# Altium schematic sheet FPGA_EEM_Misc.SchDoc
size 420 x 297 mm; EDA_Number: ARTIQ; CompanyName: WUT ISE; Organization: WUT ISE; DocumentNumber: 18; SheetNumber: 6; ModifiedBy: -; Title2: FPGA EEM/BP + MISC; ModifiedDate: -
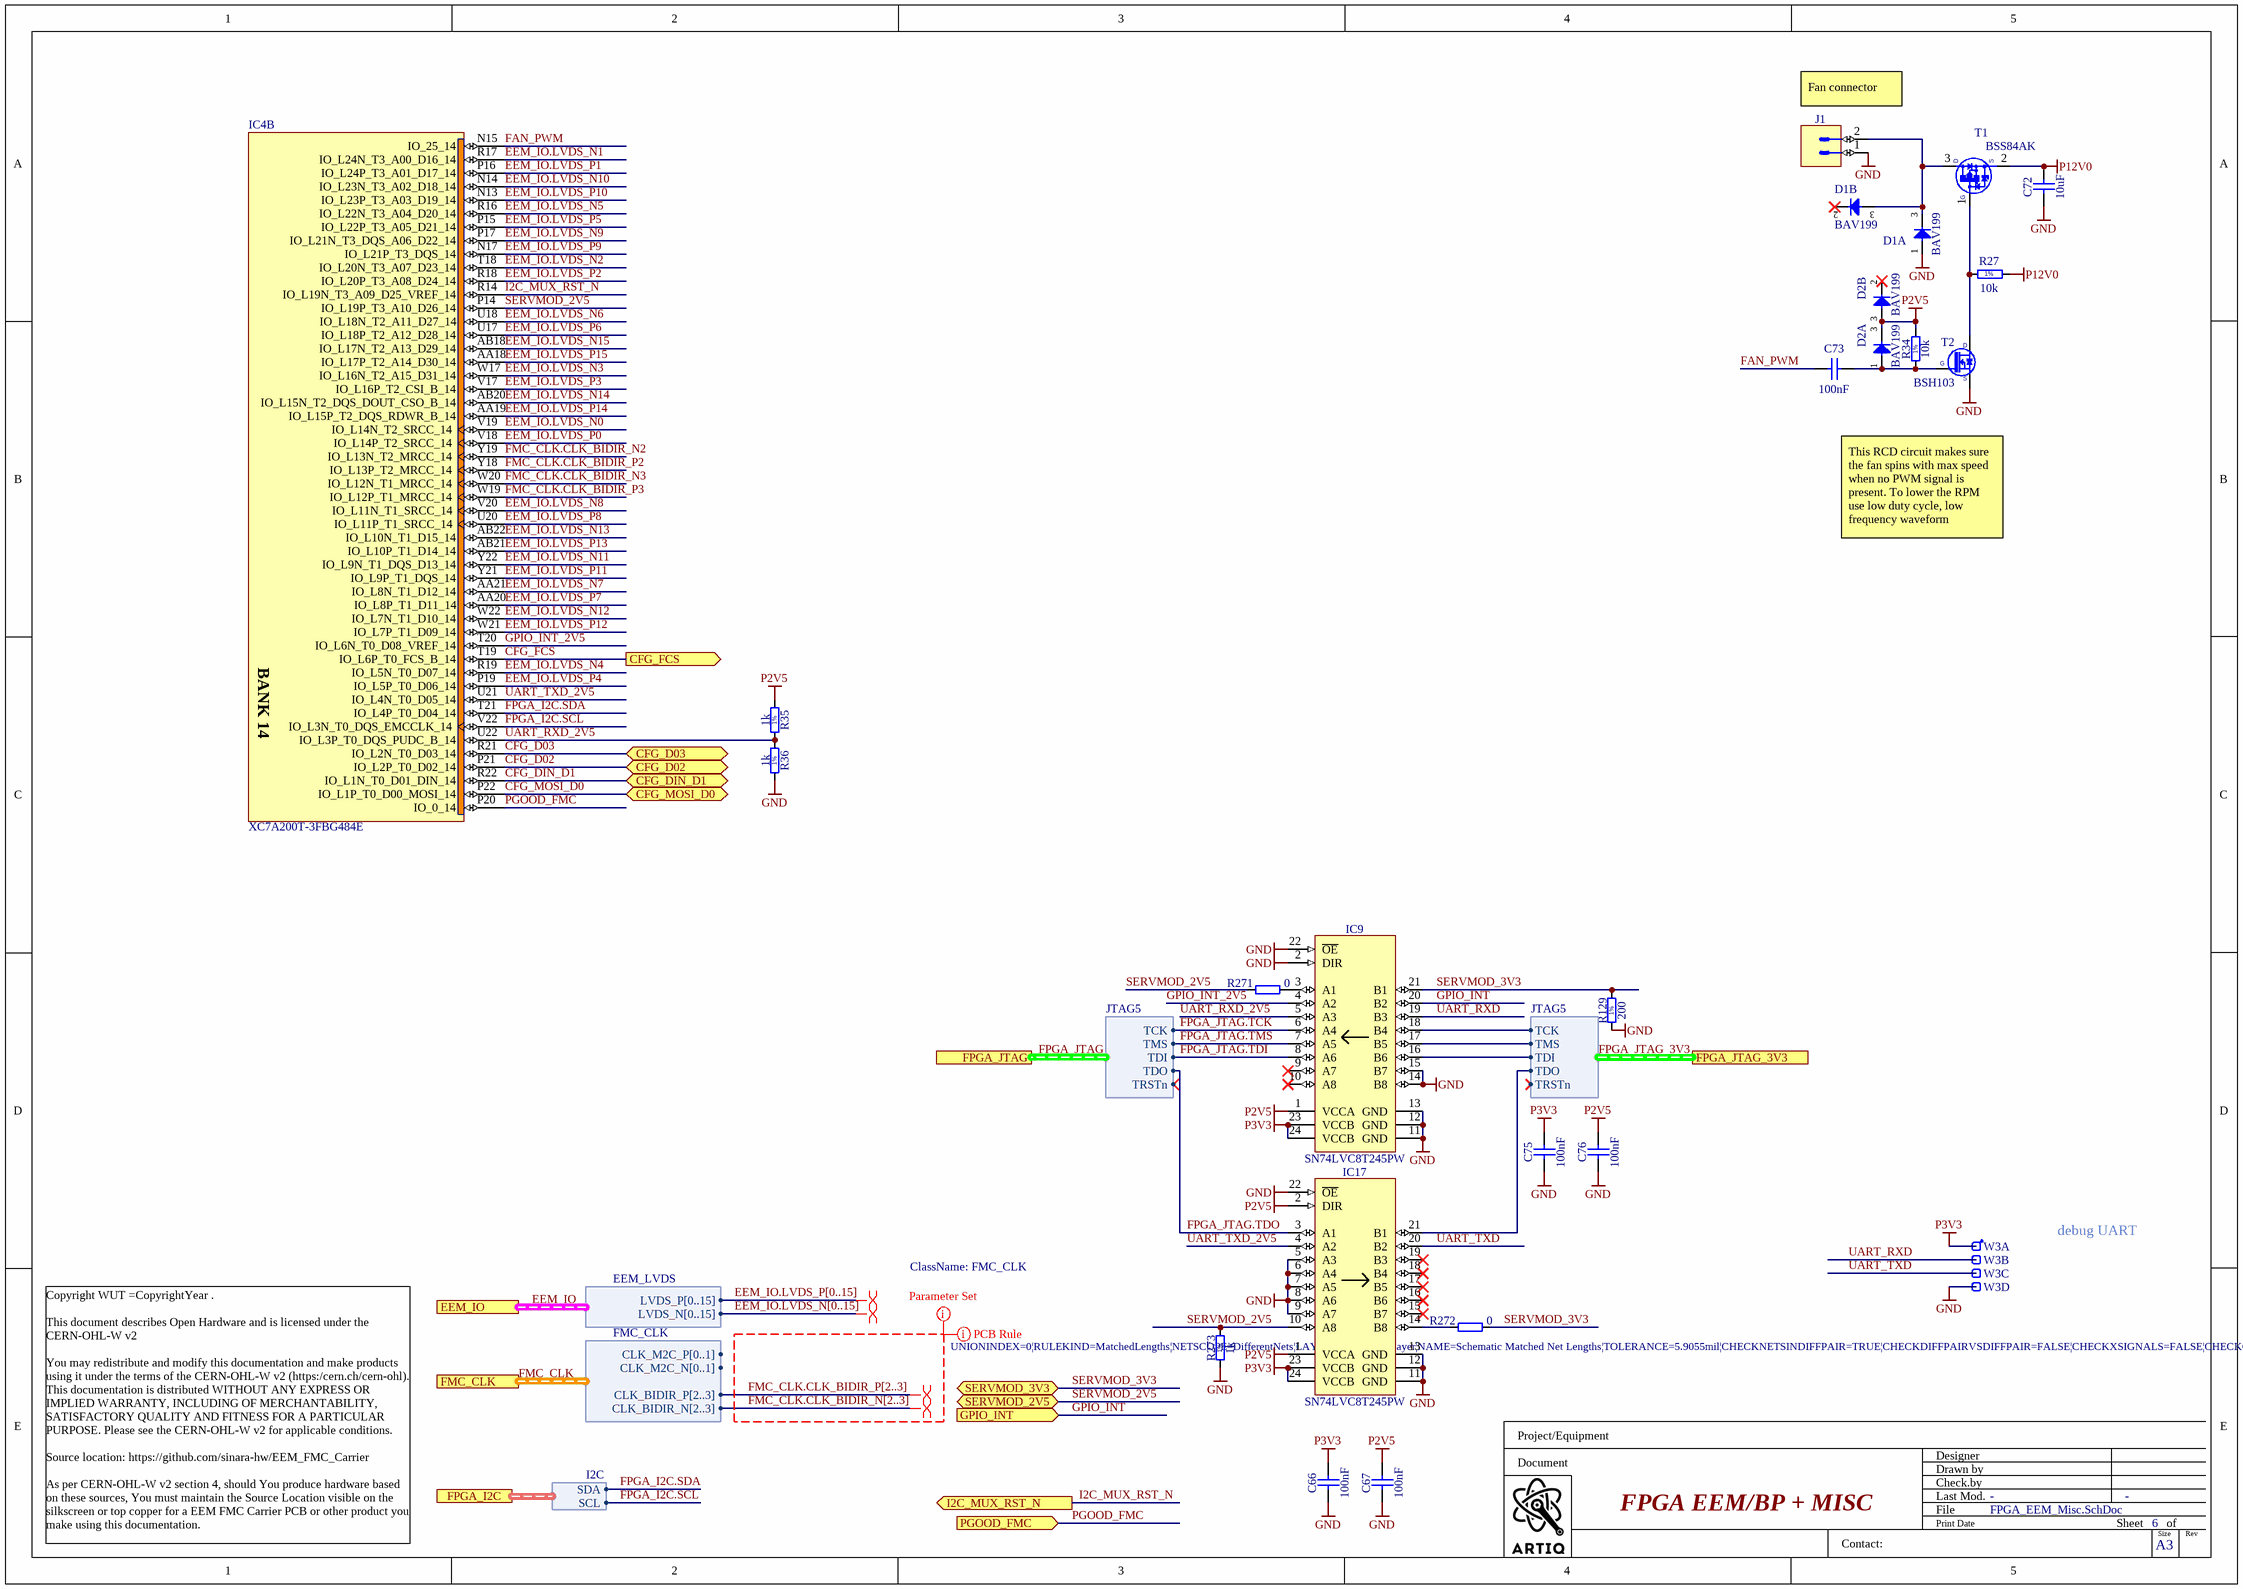
[diagram p0: FPGA_EEM_Misc.SchDoc]

## Parts
C66  100nF  [CAPC1005X55N]
C67  100nF  [CAPC1005X55N]
C72  10uF  [CAPC2012X95N]
C73  100nF  [CAPC0603X33N]
C75  100nF  [CAPC1005X55N]
C76  100nF  [CAPC1005X55N]
D1  BAV199  [SOT95P240X110-3N]  (parts A,B of 2)
D2  BAV199  [SOT95P240X110-3N]  (parts A,B of 2)
IC4  XC7A200T-3FBG484E  [BGA484C100P22X22_2300X2300X254]  (part B of 10)
IC9  SN74LVC8T245PW  [SOP65P640X120-24N]
IC17  SN74LVC8T245PW  [SOP65P640X120-24N]
J1  KK®  [MOLEX_22-27-2021]  (value not drawn)
R27  10k  [RESC1005X40N]
R34  10k  [RESC1005X40N]
R35  1k  [RESC1005X40N]
R36  1k  [RESC1005X40N]
R129  200  [RESC1005X40N]
R271  0  [RESC1005X40N]
R272  0  [RESC1005X40N]
R273  1k  [RESC1005X40N]
T1  BSS84AK  [SOT95P230X110-3N]
T2  BSH103  [SOT95P230X110-3N]
W3  Header 4  [SAMTEC_HTSW-104-23-L-S]  (value not drawn)  (parts A,B,C,D of 4)

## Ports
CFG_D02 (bidir), CFG_D03 (bidir), CFG_DIN_D1 (bidir), CFG_FCS (out), CFG_MOSI_D0 (bidir), EEM_IO (harness EEM_LVDS), FMC_CLK (harness FMC_CLK), FPGA_I2C (harness I2C), FPGA_JTAG (harness JTAG5), FPGA_JTAG_3V3 (harness JTAG5), GPIO_INT (in), I2C_MUX_RST_N (out), PGOOD_FMC (in), SERVMOD_2V5 (bidir), SERVMOD_3V3 (bidir)

## Harnesses
FMC_CLK: CLK_M2C_P[0..1], CLK_M2C_N[0..1], CLK_BIDIR_P[2..3], CLK_BIDIR_N[2..3]
EEM_LVDS: LVDS_P[0..15], LVDS_N[0..15]
I2C: SDA, SCL
JTAG5: TCK, TDI, TDO, TMS, TRSTn

## Nets
GND: C66.1 C67.1 C72.1 C75.1 C76.1 D1.1(A) IC9.2(DIR) IC9.11(GND) IC9.12(GND) IC9.13(GND) IC9.14(B8) IC9.15(B7) IC9.22(~{OE}) IC17.5(A3) IC17.6(A4) IC17.7(A5) IC17.8(A6) IC17.9(A7) IC17.11(GND) IC17.12(GND) IC17.13(GND) IC17.22(~{OE}) J1.1 R36.1 R129.1 R273.1 T2.2(S) W3.4
P2V5: C67.2 C76.2 D2.3(COMAC) IC9.1(VCCA) IC17.1(VCCA) IC17.2(DIR) R34.2 R35.2
P3V3: C66.2 C75.2 IC9.23(VCCB) IC9.24(VCCB) IC17.23(VCCB) IC17.24(VCCB) W3.1
P12V0: C72.2 R27.2 T1.2(S)
CFG_D02: IC4.P21(IO_L2P_T0_D02_14) ; port CFG_D02
CFG_D03: IC4.R21(IO_L2N_T0_D03_14) ; port CFG_D03
CFG_DIN_D1: IC4.R22(IO_L1N_T0_D01_DIN_14) ; port CFG_DIN_D1
CFG_FCS: IC4.T19(IO_L6P_T0_FCS_B_14) ; port CFG_FCS
CFG_MOSI_D0: IC4.P22(IO_L1P_T0_D00_MOSI_14) ; port CFG_MOSI_D0
EEM_IO.LVDS_N0: IC4.V19(IO_L14N_T2_SRCC_14)
EEM_IO.LVDS_N1: IC4.R17(IO_L24N_T3_A00_D16_14)
EEM_IO.LVDS_N2: IC4.T18(IO_L20N_T3_A07_D23_14)
EEM_IO.LVDS_N3: IC4.W17(IO_L16N_T2_A15_D31_14)
EEM_IO.LVDS_N4: IC4.R19(IO_L5N_T0_D07_14)
EEM_IO.LVDS_N5: IC4.R16(IO_L22N_T3_A04_D20_14)
EEM_IO.LVDS_N6: IC4.U18(IO_L18N_T2_A11_D27_14)
EEM_IO.LVDS_N7: IC4.AA21(IO_L8N_T1_D12_14)
EEM_IO.LVDS_N8: IC4.V20(IO_L11N_T1_SRCC_14)
EEM_IO.LVDS_N9: IC4.P17(IO_L21N_T3_DQS_A06_D22_14)
EEM_IO.LVDS_N10: IC4.N14(IO_L23N_T3_A02_D18_14)
EEM_IO.LVDS_N11: IC4.Y22(IO_L9N_T1_DQS_D13_14)
EEM_IO.LVDS_N12: IC4.W22(IO_L7N_T1_D10_14)
EEM_IO.LVDS_N13: IC4.AB22(IO_L10N_T1_D15_14)
EEM_IO.LVDS_N14: IC4.AB20(IO_L15N_T2_DQS_DOUT_CSO_B_14)
EEM_IO.LVDS_N15: IC4.AB18(IO_L17N_T2_A13_D29_14)
EEM_IO.LVDS_P0: IC4.V18(IO_L14P_T2_SRCC_14)
EEM_IO.LVDS_P1: IC4.P16(IO_L24P_T3_A01_D17_14)
EEM_IO.LVDS_P2: IC4.R18(IO_L20P_T3_A08_D24_14)
EEM_IO.LVDS_P3: IC4.V17(IO_L16P_T2_CSI_B_14)
EEM_IO.LVDS_P4: IC4.P19(IO_L5P_T0_D06_14)
EEM_IO.LVDS_P5: IC4.P15(IO_L22P_T3_A05_D21_14)
EEM_IO.LVDS_P6: IC4.U17(IO_L18P_T2_A12_D28_14)
EEM_IO.LVDS_P7: IC4.AA20(IO_L8P_T1_D11_14)
EEM_IO.LVDS_P8: IC4.U20(IO_L11P_T1_SRCC_14)
EEM_IO.LVDS_P9: IC4.N17(IO_L21P_T3_DQS_14)
EEM_IO.LVDS_P10: IC4.N13(IO_L23P_T3_A03_D19_14)
EEM_IO.LVDS_P11: IC4.Y21(IO_L9P_T1_DQS_14)
EEM_IO.LVDS_P12: IC4.W21(IO_L7P_T1_D09_14)
EEM_IO.LVDS_P13: IC4.AB21(IO_L10P_T1_D14_14)
EEM_IO.LVDS_P14: IC4.AA19(IO_L15P_T2_DQS_RDWR_B_14)
EEM_IO.LVDS_P15: IC4.AA18(IO_L17P_T2_A14_D30_14)
FAN_PWM: C73.2 IC4.N15(IO_25_14)
FMC_CLK.CLK_BIDIR_N2: IC4.Y19(IO_L13N_T2_MRCC_14)
FMC_CLK.CLK_BIDIR_N3: IC4.W20(IO_L12N_T1_MRCC_14)
FMC_CLK.CLK_BIDIR_P2: IC4.Y18(IO_L13P_T2_MRCC_14)
FMC_CLK.CLK_BIDIR_P3: IC4.W19(IO_L12P_T1_MRCC_14)
FPGA_I2C.SCL: IC4.V22(IO_L3N_T0_DQS_EMCCLK_14) ; port FPGA_I2C.SCL
FPGA_I2C.SDA: IC4.T21(IO_L4P_T0_D04_14) ; port FPGA_I2C.SDA
FPGA_JTAG.TCK: IC9.6(A4) ; port FPGA_JTAG.TCK
FPGA_JTAG.TDI: IC9.8(A6) ; port FPGA_JTAG.TDI
FPGA_JTAG.TDO: IC17.3(A1) ; port FPGA_JTAG.TDO
FPGA_JTAG.TMS: IC9.7(A5) ; port FPGA_JTAG.TMS
FPGA_JTAG_3V3.TCK: IC9.18(B4) ; port FPGA_JTAG_3V3.TCK
FPGA_JTAG_3V3.TDI: IC9.16(B6) ; port FPGA_JTAG_3V3.TDI
FPGA_JTAG_3V3.TDO: IC17.21(B1) ; port FPGA_JTAG_3V3.TDO
FPGA_JTAG_3V3.TMS: IC9.17(B5) ; port FPGA_JTAG_3V3.TMS
GPIO_INT: IC9.20(B2) ; port GPIO_INT
GPIO_INT_2V5: IC4.T20(IO_L6N_T0_D08_VREF_14) IC9.4(A2)
I2C_MUX_RST_N: IC4.R14(IO_L19N_T3_A09_D25_VREF_14) ; port I2C_MUX_RST_N
PGOOD_FMC: IC4.P20(IO_0_14) ; port PGOOD_FMC
SERVMOD_2V5: IC4.P14(IO_L19P_T3_A10_D26_14) IC17.10(A8) R271.2 R273.2 ; port SERVMOD_2V5
SERVMOD_3V3: IC9.21(B1) R129.2 R272.1 ; port SERVMOD_3V3
UART_RXD: IC9.19(B3) W3.2
UART_RXD_2V5: IC4.U22(IO_L3P_T0_DQS_PUDC_B_14) IC9.5(A3) R35.1 R36.2
UART_TXD: IC17.20(B2) W3.3
UART_TXD_2V5: IC4.U21(IO_L4N_T0_D05_14) IC17.4(A2)
NetC73_1: C73.1 D2.1(A) R34.1 T2.1(G)
NetD1_3: D1.3(COMAC) J1.2 T1.3(D)
NetIC9_3: IC9.3(A1) R271.1
NetIC17_14: IC17.14(B8) R272.2
NetR27_1: R27.1 T1.1(G) T2.3(D)

Not connected (* = marked no-connect by the designer): D1 2(C)*; D2 2(C)*; IC9 9(A7)* 10(A8)*; IC17 15(B7)* 16(B6)* 17(B5)* 18(B4)* 19(B3)*

## Buses and harness runs
bus EEM_IO.LVDS_N[0..15]
bus EEM_IO.LVDS_P[0..15]
bus FMC_CLK.CLK_BIDIR_N[2..3]
bus FMC_CLK.CLK_BIDIR_P[2..3]
harness EEM_IO = port EEM_IO
harness FMC_CLK = port FMC_CLK
harness FPGA_JTAG = port FPGA_JTAG
harness FPGA_JTAG_3V3 = port FPGA_JTAG_3V3

## Layout directives
net class FMC_CLK: FMC_CLK.CLK_BIDIR_N[2..3], FMC_CLK.CLK_BIDIR_P[2..3]
rule Matched Net Lengths [Delay Tolerance = 11ps]: FMC_CLK.CLK_BIDIR_N[2..3], FMC_CLK.CLK_BIDIR_P[2..3]
differential pair: (no net found under the mark), FMC_CLK.CLK_BIDIR_N[2..3], FMC_CLK.CLK_BIDIR_P[2..3]

## Notes on the sheet
- (near J1) Fan connector
- This RCD circuit makes sure the fan spins with max speed when no PWM signal is present. To lower the RPM use low duty cycle, low frequency waveform
- (near W3) debug UART
- Project/Equipment
- Document
- Designer
- Drawn by
- Check.by
- Copyright WUT =CopyrightYear .
  This document describes Open Hardware and is licensed under the CERN-OHL-W v2
  You may redistribute and modify this documentation and make products using it under the terms of the CERN-OHL-W v2 (https:/cern.ch/cern-ohl). This documentation is distributed WITHOUT ANY EXPRESS OR IMPLIED WARRANTY, INCLUDING OF MERCHANTABILITY, SATISFACTORY QUALITY AND FITNESS FOR A PARTICULAR PURPOSE. Please see the CERN-OHL-W v2 for applicable conditions.
  Source location: https://github.com/sinara-hw/EEM_FMC_Carrier
  As per CERN-OHL-W v2 section 4, should You produce hardware based on these sources, You must maintain the Source Location visible on the silkscreen or top copper for a EEM FMC Carrier PCB or other product you make using this documentation.
- Contact:
- File
- Last Mod.
- Print Date
- Sheet
- Size
- A3
- of
- Rev
- (in symbol R0402_1K_1%_0.0625W_100PPM) 1%
- (in symbol R0402_10K_1%_0.0625W_100PPM) 1%
- (in symbol R0402_200R_1%_0.0625W_100PPM) 1%
- (in symbol XC7A200T-3FBG484E, part B) BANK 14

## Library data of the parts
C66 C67 C75 C76 = CC0402_100NF_25V_10%_X7R_YUDEN_TMK105B7104KVHF: Non-polarised capacitor; Part Description: SMD Multilayer Chip Ceramic Capacitor (High Dielectric Type) for Automotive / Industrial Applications; Manufacturer: TAIYO YUDEN; Voltage: 25V; TC: X7R; Tolerance: ±10%; Part Number: CC0402_100NF_25V_10%_X7R_YUDEN_TMK105B7104KVHF; Component Kind: Standard; Component Type: Standard; Pin Count: 2; Value: 100nF; Status: Not Recommended; Manufacturer Part Number: TMK105B7104KVHF; Case: 0402; Mounted: Yes; Socket: No; SMD: Yes; Sense: No; HelpURL: \\cern.ch\dfs\Applications\Altium\Datasheets\CC0402_TAIYO-YUDEN_TMK105B7104KVHF.pdf; Author: CERN DEM JLC; CreateDate: 10-May-17; LatestRevisionDate: 10-May-17; ComponentHeight: 0.55mm
C72 = CC0805_10UF_25V_10%_X5R: Non-polarised capacitor; Part Description: SMD Multilayer Chip Ceramic Capacitor; Manufacturer: GENERIC; Manufacturer1 Part Number: GRM219R61E106KA12D; Voltage: 25V; TC: X5R; Tolerance: ±10%; Part Number: CC0805_10UF_25V_10%_X5R; Component Kind: Standard; Component Type: Standard; Pin Count: 2; Value: 10uF; Status: Preferred; Manufacturer Part Number: CC0805_10UF_25V_10%_X5R; Case: 0805; Mounted: Yes; Socket: No; SMD: Yes; Manufacturer1 Example: MURATA; Manufacturer1 ComponentHeight: 0.95mm; HelpURL: \\cern.ch\dfs\Applications\Altium\Datasheets\CC0805_X5R_MURATA_GRM.pdf; Author: CERN DEM JLC; CreateDate: 25.10.2012; LatestRevisionDate: 06.09.2016; Sense: No
C73 = CC0201_100NF_6.3V_10%_X5R: Non-polarised capacitor; Part Description: SMD Multilayer Chip Ceramic Capacitor; Manufacturer: GENERIC; Manufacturer1 Part Number: 02016D104KAT2A; Voltage: 6.3V; TC: X5R; Tolerance: ±10%; Part Number: CC0201_100NF_6.3V_10%_X5R; Component Kind: Standard; Component Type: Standard; Pin Count: 2; Value: 100nF; Status: Not Recommended; Manufacturer Part Number: CC0201_100NF_6.3V_10%_X5R; Case: 0201; Mounted: Yes; Socket: No; SMD: Yes; Sense: No; Manufacturer1 Example: AVX; Manufacturer1 ComponentHeight: 0.33mm; HelpURL: \\cern.ch\dfs\Applications\Altium\Datasheets\CC0201_X5R_AVX.pdf; Author: CERN DEM JLC; CreateDate: 2007-12-03; LatestRevisionDate: 2007-12-03; ClassName: FPGA_JTAG
D1 D2 = BAV199: Serial Diode; Part Description: Low-Leakage Double Diode; Manufacturer: NXP SEMICONDUCTORS; Voltage: 75V; Power: 250mW; PressFit: No; Bonding: No; Part Number: BAV199; Component Kind: Standard; Component Type: Standard; Device: BAV199; PackageDescription: SOT23 3-Leads, Pitch 0.95mm - Body 1.4x3mm, IPC Medium Density; Manufacturer Part Number: BAV199; Pin Count: 3; Case: SOT23-3; Mounted: Yes; Socket: No; SMD: Yes; Sense: No; ComponentHeight: 1.1mm; HelpURL: \\cern.ch\dfs\Applications\Altium\Datasheets\BAV199.pdf; Author: CERN DEM JMW; CreateDate: 2008-11-21; LatestRevisionDate: 2008-11-21
IC4 = XC7A200T-3FBG484E: Artix-7 FPGA, 285 User I/Os, 4 GTP, 484-Ball BGA, Pb-Free; Manufacturer Part Number: XC7A200T-3FBG484E; Device: XC7A200T-3FBG484E
IC9 IC17 = SN74LVC8T245PW: 8-Bit Dual-Supply Bus Transceiver With Configurable Voltage Translation and 3-State Outputs; Manufacturer: TEXAS INSTRUMENTS; PressFit: No; Bonding: No; Part Number: SN74LVC8T245PW; Component Kind: Standard; Component Type: Standard; Device: SN74LVC8T245PW; PackageDescription: SOP, 0.65mm Pitch; 24 Pin, 4.40mm W X 7.80mm L X 1.20mm H Body, IPC Medium Density; Part Description: 8-Bit Dual-Supply Bus Transceiver With Configurable Voltage Translation and 3-State Outputs; Manufacturer Part Number: SN74LVC8T245PW; Pin Count: 24; Case: TSSOP24; Mounted: Yes; Socket: No; SMD: Yes; Sense: No; ComponentHeight: 1.2mm; Author: CERN DEM JLC; HelpURL: \\cern.ch\dfs\Applications\Altium\Datasheets\SN74LVC8T245PW.pdf; CreateDate: 02.09.2009; LatestRevisionDate: 02.09.2009
J1 = MOLEX_22-27-2021: Connector 2 Male; Part Description: 2.54mm (.100") Pitch KK® Wire-to-Board Header, Vertical, with Friction Lock, 2 Circuits, Tin (Sn) Plating; Manufacturer: MOLEX; PressFit: No; Part Number: MOLEX_22-27-2021; Component Kind: Standard; Component Type: Standard; Pin Count: 2; Family: KK®; Mounted: Yes; Socket: No; SMD: No; Sense: No; Status: None; Manufacturer Part Number: 22-27-2021; ComponentHeight: 11.7mm; HelpURL: \\cern.ch\dfs\Applications\Altium\Datasheets\MOLEX_22-27-2021.pdf; Author: CERN DEM JLC; CreateDate: 04.12.2008; LatestRevisionDate: 04.12.2008
R27 R34 = R0402_10K_1%_0.0625W_100PPM: Resistor - 1%; Part Description: General Purpose Thick Film Chip Resistor; Manufacturer: GENERIC; Manufacturer1 Part Number: 232270671003L; TC: ±100ppm/°C; PressFit: No; Part Number: R0402_10K_1%_0.0625W_100PPM; Component Kind: Standard; Component Type: Standard; Pin Count: 2; Value: 10k; Status: Not Recommended; Power: 0.0625W; Tolerance: ±1%; Manufacturer Part Number: R0402_10K_1%_0.0625W_100PPM; Case: 0402; Mounted: Yes; Sense: No; Socket: No; SMD: Yes; Manufacturer1 Example: YAGEO PHYCOMP; Manufacturer1 ComponentHeight: 0.4mm; HelpURL: \\cern.ch\dfs\Applications\Altium\Datasheets\R0402_Phycomp_RC0402.pdf; Author: CERN DEM JLC; CreateDate: 03.12.2007; LatestRevisionDate: 17.10.2012
R35 R36 R273 = R0402_1K_1%_0.0625W_100PPM: Resistor - 1%; Part Description: General Purpose Thick Film Chip Resistor; Manufacturer: GENERIC; Manufacturer1 Part Number: 232270671002L; TC: ±100ppm/°C; PressFit: No; Part Number: R0402_1K_1%_0.0625W_100PPM; Component Kind: Standard; Component Type: Standard; Pin Count: 2; Value: 1k; Status: Not Recommended; Power: 0.0625W; Tolerance: ±1%; Manufacturer Part Number: R0402_1K_1%_0.0625W_100PPM; Case: 0402; Mounted: Yes; Sense: No; Socket: No; SMD: Yes; Manufacturer1 Example: YAGEO PHYCOMP; Manufacturer1 ComponentHeight: 0.4mm; HelpURL: \\cern.ch\dfs\Applications\Altium\Datasheets\R0402_Phycomp_RC0402.pdf; Author: CERN DEM JLC
  R35 R36: CreateDate: 03.12.2007; LatestRevisionDate: 17.10.2012; ClassName: Artix
  R273: CreateDate: 2007-12-03; LatestRevisionDate: 2012-10-17
R129 = R0402_200R_1%_0.0625W_100PPM: Resistor - 1%; Part Description: General Purpose Thick Film Chip Resistor; Manufacturer: GENERIC; Manufacturer1 Part Number: 232270672001L; TC: ±100ppm/°C; PressFit: No; Part Number: R0402_200R_1%_0.0625W_100PPM; Component Kind: Standard; Component Type: Standard; Pin Count: 2; Value: 200; Status: Not Recommended; Power: 0.0625W; Tolerance: ±1%; Manufacturer Part Number: R0402_200R_1%_0.0625W_100PPM; Case: 0402; Mounted: Yes; Sense: No; Socket: No; SMD: Yes; Manufacturer1 Example: YAGEO PHYCOMP; Manufacturer1 ComponentHeight: 0.4mm; HelpURL: \\cern.ch\dfs\Applications\Altium\Datasheets\R0402_Phycomp_RC0402.pdf; Author: CERN DEM JLC; CreateDate: 2007-12-03; LatestRevisionDate: 2012-10-17
R271 R272 = R0402_0R_JUMPER: Resistor; Part Description: 1A (0.05R Max DC Resistance) Zero Ohm Jumper; Manufacturer: GENERIC; Manufacturer1 Part Number: 232270591001L; PressFit: No; Part Number: R0402_0R_JUMPER; Component Kind: Standard; Component Type: Standard; Pin Count: 2; Value: 0; Status: Not Recommended; Manufacturer Part Number: R0402_0R_JUMPER; Case: 0402; Mounted: Yes; Socket: No; SMD: Yes; Manufacturer1 Example: YAGEO PHYCOMP; Manufacturer1 ComponentHeight: 0.4mm; HelpURL: \\cern.ch\dfs\Applications\Altium\Datasheets\R0402_Phycomp_RC0402.pdf; Author: CERN DEM JLC; CreateDate: 03.12.2007; LatestRevisionDate: 17.10.2012; Sense: No
T1 = BSS84AK: 50V, 180mA P-Channel Trench MOSFET; Part Description: 50V, 180mA P-channel Trench MOSFET Transistor; Manufacturer: NXP SEMICONDUCTORS; PressFit: No; Bonding: No; Part Number: BSS84AK; Component Kind: Standard; Component Type: Standard; Device: BSS84AK; PackageDescription: SOT23, 0.95mm Pitch; 3 Pin, 1.30mm W X 2.90mm L X 1.10mm H body, IPC Medium Density; Manufacturer Part Number: BSS84AK; Pin Count: 3; Case: SOT23-3; Mounted: Yes; Socket: No; SMD: Yes; Sense: No; ComponentHeight: 1.1mm; HelpURL: \\cern.ch\dfs\Applications\Altium\Datasheets\BSS84AK.pdf; Author: CERN DEM JLC; CreateDate: 16.04.2015; LatestRevisionDate: 16.04.2015
T2 = BSH103: N-CHANNEL MOSFET WITH DIODE; Part Description: 30V 850mA N-Channel Enhancement Mode Field-Effect Transistor; Manufacturer: NEXPERIA; PressFit: No; Bonding: No; Part Number: BSH103; Component Kind: Standard; Component Type: Standard; Device: BSH103; PackageDescription: SOT23, 0.95mm Pitch; 3 Pin, 1.30mm W X 2.90mm L X 1.10mm H body, IPC Medium Density; Manufacturer Part Number: BSH103; Pin Count: 3; Case: SOT23-3; Mounted: Yes; Socket: No; SMD: Yes; Sense: No; ComponentHeight: 1.1mm; HelpURL: \\cern.ch\dfs\Applications\Altium\Datasheets\BSH103.pdf; Author: CERN DEM JLC; CreateDate: 16.03.2010; LatestRevisionDate: 20.06.2017
W3 = SAMTEC_HTSW-104-23-L-S: 4 Mini Wire-Wrap Contact Strip Header; Part Description: 4 Contacts, Pitch 2.54mm, Single Row  Through Mount Straight Header (Post Lead 5.84mm, Tail Lead 2.92mm, Insulator 2.54mm); Manufacturer: SAMTEC; PressFit: No; Status Comment: High Temperature; Part Number: SAMTEC_HTSW-104-23-L-S; Component Kind: Standard; Component Type: Standard; Pin Count: 4; Family: Header 4; Mounted: Yes; Socket: No; Sense: No; SMD: No; Status: Preferred; Manufacturer Part Number: HTSW-104-23-L-S; ComponentHeight: 8.38mm; HelpURL: \\cern.ch\dfs\Applications\Altium\Datasheets\SAMTEC_HTSW-104-23-L-S.pdf; Author: CERN DEM JLC; CreateDate: 22/02/2018; LatestRevisionDate: 22/02/2018